# EAGLE design TS12A4514DBVR (EAGLE 7.2.0)
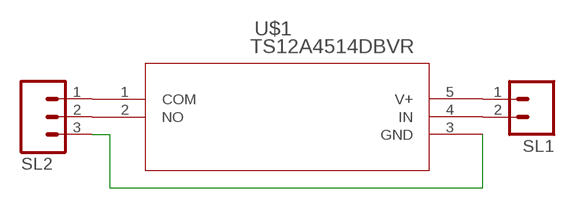
[diagram p0: schematic, sheet 1]

## Parts
SL1  M02  [02P]
SL2  M03  [03P]
U$1  TS12A4514DBVR  [DBV5]

## Nets
N$1: SL1.1 U$1.5(V+)
N$2: SL1.2 U$1.4(IN)
N$3: SL2.1 U$1.1(COM)
N$4: SL2.2 U$1.2(NO)
N$5: SL2.3 U$1.3(GND)

## Library data of the parts
SL1 = con-amp-quick:M02: AMP QUICK CONNECTOR; OC_FARNELL: unknown; OC_NEWARK: unknown
SL2 = con-amp-quick:M03: AMP QUICK CONNECTOR; OC_FARNELL: unknown; OC_NEWARK: unknown
U$1 = TS12A4514DBVR:TS12A4514DBVR; 3D_LIBRARY_NAME: TI_AllParts_20121225; COPYRIGHT: Copyright C 2015 Accelerated Designs. All rights reserved; DATASHEETURL: httpwww.ti.comlitgpnTS12A4514; FAMILY_NAME: ANALOG SWITCH OR MULTIPLEXER greater than 5V; GENERIC_PART_NUMBER: TS12A4514; INDUSTRY_STD_PKG_TYPE: SOT23; MANUFACTURER: Texas Instruments; MANUFACTURER_PART_NUMBER: TS12A4514DBVR; PACKAGE_DESIGNATOR: DBV; PIN_COUNT: 5; VENDOR: Texas Instruments

## Board
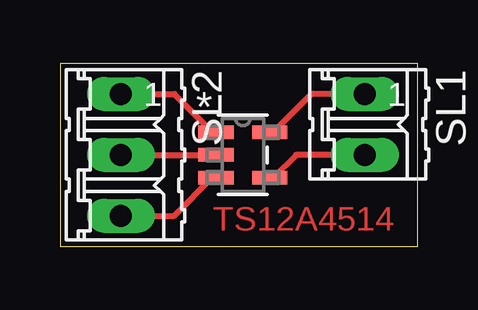
[diagram p1: board, top side]

Size 14.91 x 7.61 mm. Coordinates in mm from the lower left corner, seen from the top.
Outline: 0,0 14.91,0 14.91,7.61 0,7.61 0,0
Copper layers (1*16): Top 0.035mm / dielectric 1.5mm / Bottom 0.035mm
Design rules "default": minimum track width 10mil, minimum drill 24mil, track to track 8mil, track to pad 8mil, pad to pad 8mil, via to via 8mil, smd to smd 8mil, copper to edge 40mil, drill to drill 8mil, minimum pad ring 10mil, minimum via ring 8mil, stop-mask expansion 4mil, vias tented up to drill 0mil, thermal gap 10mil

### Footprints (pad centres in the part's own frame; a part is rotated, then mirrored left to right if it is on the bottom)
02P = drill 0.914 long: 1 -1.27,0; 2 1.27,0
03P = drill 0.914 long: 1 -2.54,0; 2 0,0; 3 2.54,0
DBV5 = smd 1.473 x 0.559: 1 -1.118,0.95; 2 -1.118,0; 3 -1.118,-0.95; 4 1.118,-0.95; 5 1.118,0.95

### Placement (x,y rotation side)
SL1  12.7,5.08 270 top
SL2  2.54,3.81 270 top
U$1  7.62,3.81 0 top

### Tracks (layer width: path | path; a pad name or v marks a point on that pad's centre or on a via)
N$1
  Top 0.254: SL1.1 10.48,6.35 8.89,4.76 U$1.5
N$2
  Top 0.254: SL1.2 9.84,3.81 8.89,2.86 U$1.4
N$3
  Top 0.254: SL2.1 4.76,6.35 6.35,4.76 U$1.1
N$4
  Top 0.254: SL2.2 U$1.2
N$5
  Top 0.254: SL2.3 4.76,1.27 6.35,2.86 U$1.3

### Text on the board
Top: TS12A4514